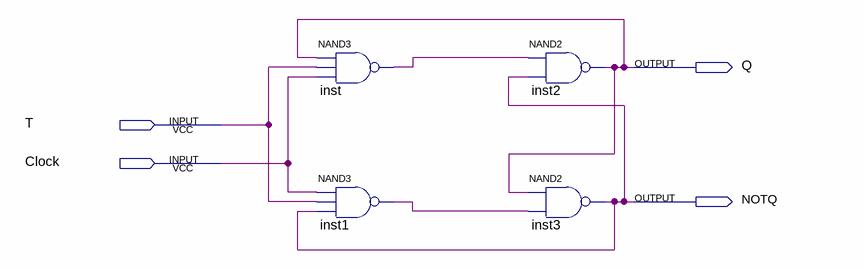
[diagram p0: schematic sheet]
// Quartus schematic TFlipFlop.bdf as structural Verilog: 4 symbols, 4 pins
module TFlipFlop (
  input  T,
  input  Clock,
  output Q,
  output NOTQ
);

  wire inst1_out, inst_out;

  nand inst (inst_out, Q, T, Clock);
  nand inst1 (inst1_out, Clock, T, NOTQ);
  nand inst2 (Q, inst_out, NOTQ);
  nand inst3 (NOTQ, Q, inst1_out);
endmodule
